# EAGLE design multiplexer (EAGLE 6.1)
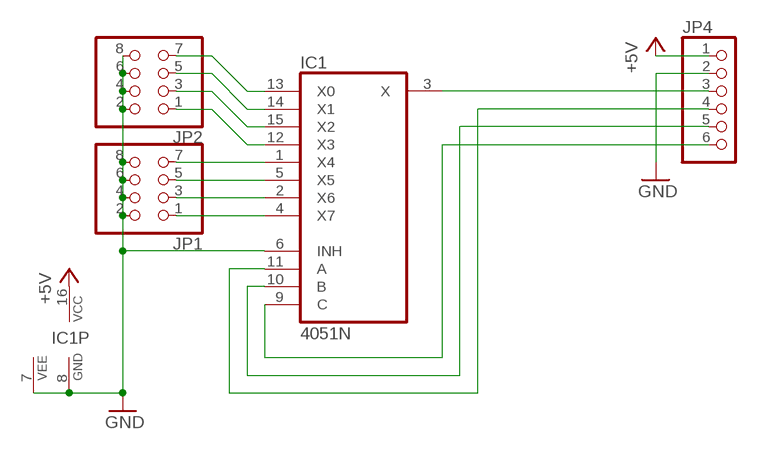
[diagram p0: schematic, sheet 1]

## Parts
IC1  4051N  [DIL16]
JP1  PINHD-2X4/90  [2X04/90]
JP2  PINHD-2X4/90  [2X04/90]
JP4  PINHD-1X6/90  [1X06/90]

## Nets
+5V: IC1.16(VCC) JP4.1
GND: IC1.6(INH) IC1.7(VEE) IC1.8(GND) JP1.2 JP1.4 JP1.6 JP1.8 JP2.2 JP2.4 JP2.6 JP2.8 JP4.2
N$1: IC1.4(X7) JP1.1
N$2: IC1.2(X6) JP1.3
N$3: IC1.5(X5) JP1.5
N$4: IC1.1(X4) JP1.7
N$5: IC1.12(X3) JP2.1
N$6: IC1.15(X2) JP2.3
N$7: IC1.14(X1) JP2.5
N$8: IC1.13(X0) JP2.7
N$9: IC1.3(X) JP4.3
N$10: IC1.9(C) JP4.6
N$11: IC1.10(B) JP4.5
N$12: IC1.11(A) JP4.4

## Library data of the parts
IC1 = 40xx:4051: 8-channel ANALOG MULTIPLEXER
JP1 JP2 = pinhead:PINHD-2X4: PIN HEADER
JP4 = pinhead:PINHD-1X6: PIN HEADER

## Board
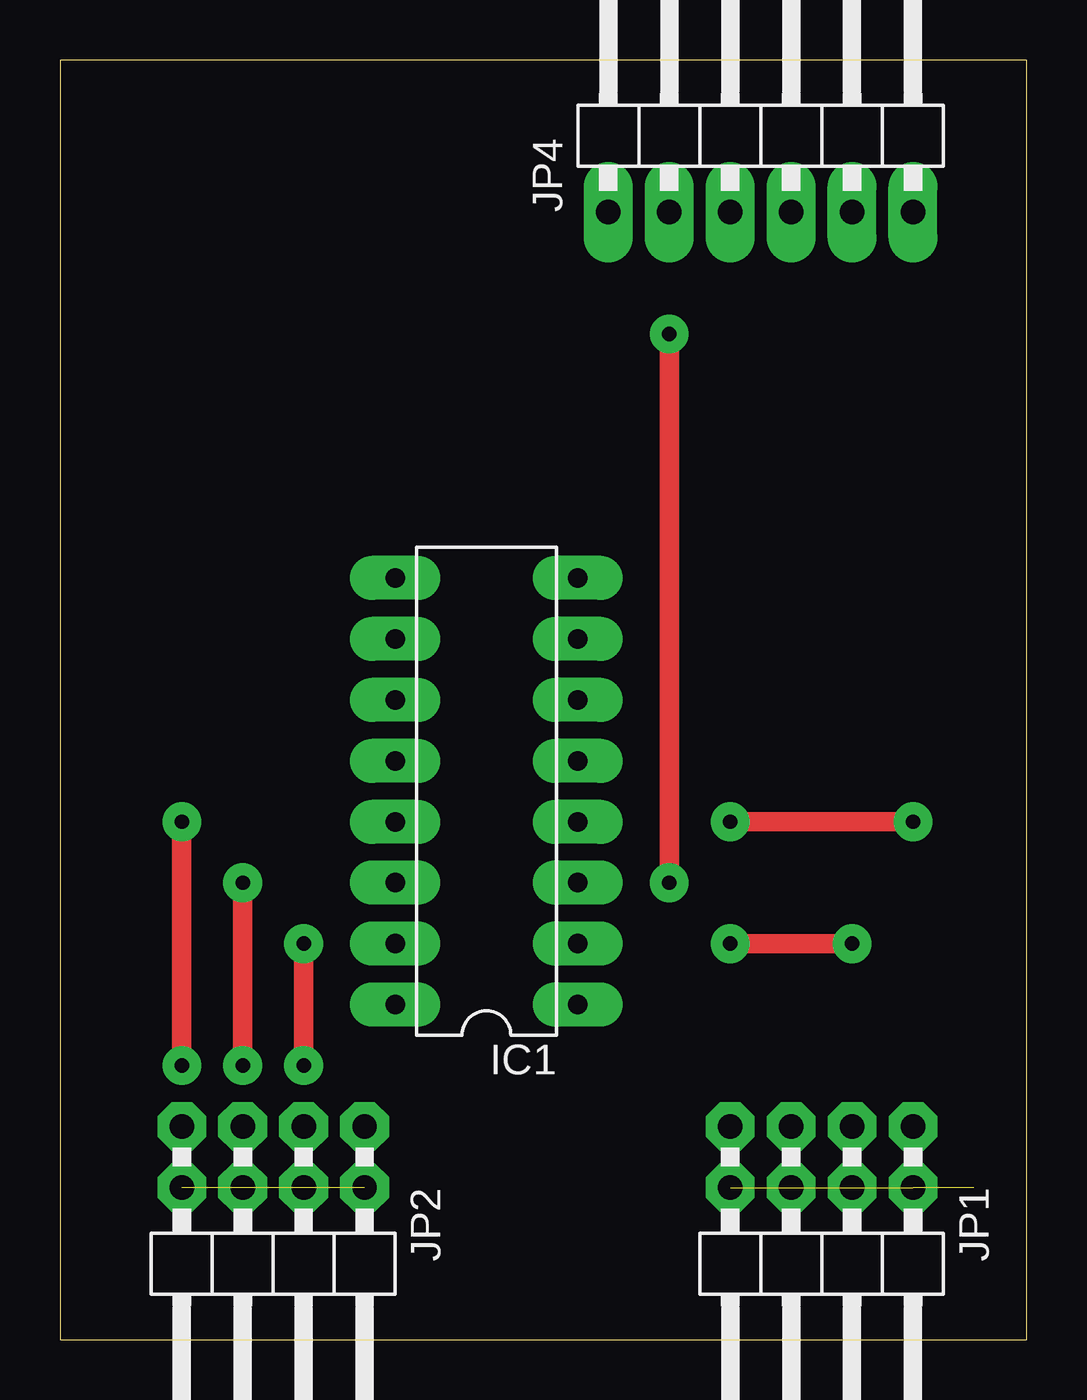
[diagram p1: board, top side]
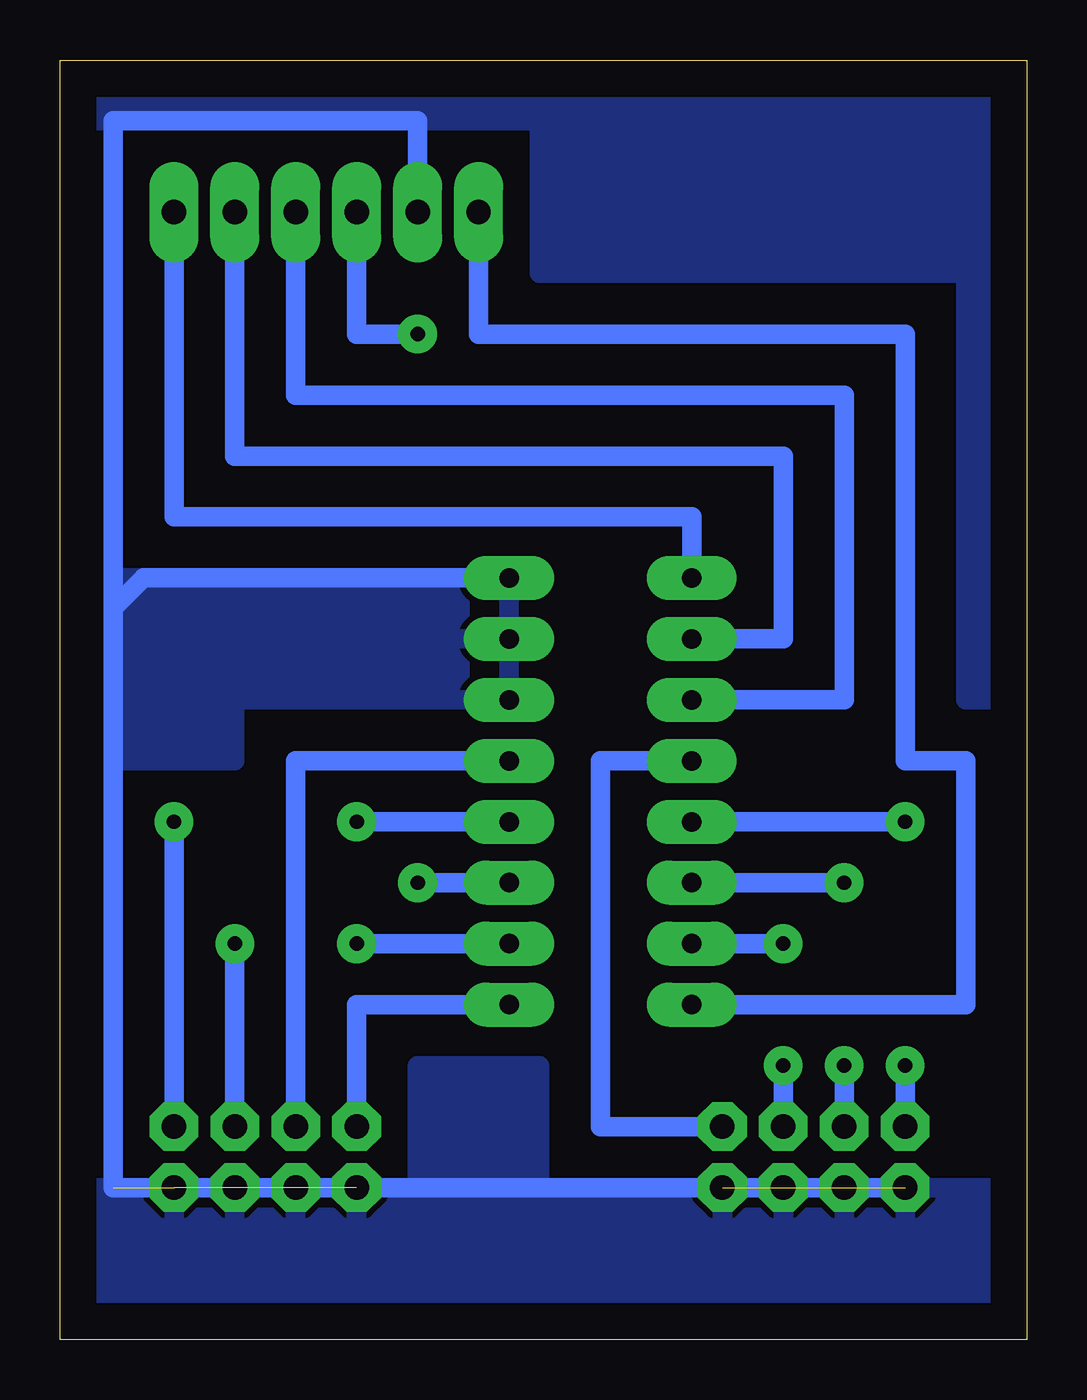
[diagram p2: board, bottom side, seen from below]

Size 40.31 x 53.33 mm. Coordinates in mm from the lower left corner, seen from the top.
Outline: 0,0 40.31,0 40.31,53.33 0,53.33 0,0
Copper layers (1*16): Top 0.035mm / dielectric 1.5mm / Bottom 0.035mm
Design rules: minimum track width 20mil, minimum drill 20mil, track to track 20mil, track to pad 20mil, pad to pad 20mil, via to via 20mil, smd to smd 10mil, copper to edge 60mil, drill to drill 20mil, minimum pad ring 20mil, minimum via ring 20mil, stop-mask expansion 4mil, vias tented up to drill 0mil, thermal gap 10mil

### Footprints (pad centres in the part's own frame; a part is rotated, then mirrored left to right if it is on the bottom)
DIL16 = drill 0.813 long: 1 -8.89,-3.81; 2 -6.35,-3.81; 3 -3.81,-3.81; 4 -1.27,-3.81; 5 1.27,-3.81; 6 3.81,-3.81; 7 6.35,-3.81; 8 8.89,-3.81; 9 8.89,3.81; 10 6.35,3.81; 11 3.81,3.81; 12 1.27,3.81; 13 -1.27,3.81; 14 -3.81,3.81; 15 -6.35,3.81; 16 -8.89,3.81
2X04/90 = drill 1.016 octagon: 1 -3.81,-6.35; 2 -3.81,-3.81; 3 -1.27,-6.35; 4 -1.27,-3.81; 5 1.27,-6.35; 6 1.27,-3.81; 7 3.81,-6.35; 8 3.81,-3.81
1X06/90 = drill 1.016 long: 1 -6.35,-3.81; 2 -3.81,-3.81; 3 -1.27,-3.81; 4 1.27,-3.81; 5 3.81,-3.81; 6 6.35,-3.81

### Placement (x,y rotation side)
IC1  17.78,22.86 90 top
JP1  31.75,2.54 180 top
JP2  8.89,2.54 180 top
JP4  29.21,50.8 0 top

### Tracks (layer width: path | path; a pad name or v marks a point on that pad's centre or on a via)
+5V
  Bottom 0.813: IC1.16 2.54,13.97 2.54,24.13 5.08,24.13 5.08,41.91 22.86,41.91 JP4.1
GND  (7 unrouted)
  Bottom 0.813: 38.1,30.48 38.1,6.35 25.4,6.35 20.32,6.35 JP2.8 | 38.1,30.48 38.1,50.8 25.4,50.8 JP4.2 | IC1.8 36.83,31.75 38.1,30.48
  pour Bottom: 21.59,31.75 21.59,26.67 33.02,26.67 33.02,24.13 38.1,24.13 38.1,31.75
  pour Bottom: 0,53.34 40.64,53.34 40.64,50.8 20.32,50.8 20.32,44.45 2.54,44.45 2.54,26.67 0,26.67
  pour Bottom: 40.64,0 40.64,6.35 26.67,6.35 25.4,6.35 25.4,11.43 20.32,11.43 20.32,6.35 0,6.35 0,0
N$1  (via drill 0.6)
  Top 0.813: v27.94,21.59 v35.56,21.59
  Bottom 0.813: IC1.4 v27.94,21.59 | v35.56,21.59 JP1.1
N$2  (via drill 0.6)
  Top 0.813: v27.94,16.51 v33.02,16.51
  Bottom 0.813: IC1.2 v27.94,16.51 | v33.02,16.51 JP1.3
N$3
  Bottom 0.813: IC1.5 30.48,24.13 JP1.5
N$4
  Bottom 0.813: IC1.1 27.94,13.97 JP1.7
N$5
  Bottom 0.813: IC1.12 17.78,24.13 17.78,8.89 JP2.1
N$6  (via drill 0.6)
  Top 0.813: v10.16,16.51 v10.16,11.43
  Bottom 0.813: IC1.15 v10.16,16.51 | v10.16,11.43 JP2.3
N$7  (via drill 0.6)
  Top 0.813: v7.62,19.05 v7.62,11.43
  Bottom 0.813: IC1.14 v7.62,19.05 | v7.62,11.43 JP2.5
N$8  (via drill 0.6)
  Top 0.813: v5.08,21.59 v5.08,11.43
  Bottom 0.813: IC1.13 v5.08,21.59 | v5.08,11.43 JP2.7
N$9  (via drill 0.6)
  Top 0.813: v25.4,41.91 v25.4,19.05
  Bottom 0.813: JP4.3 27.94,41.91 v25.4,41.91 | v25.4,19.05 IC1.3
N$10
  Bottom 0.813: JP4.6 35.56,34.29 13.97,34.29 IC1.9
N$11
  Bottom 0.813: JP4.5 33.02,36.83 10.16,36.83 10.16,29.21 IC1.10
N$12
  Bottom 0.813: JP4.4 30.48,39.37 7.62,39.37 7.62,26.67 IC1.11